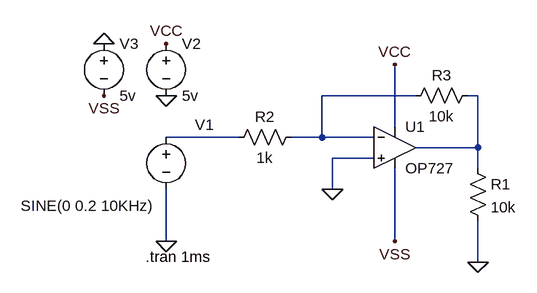
[diagram p0: schematic template1.asc]
template1.asc, the LTspice schematic file:
Version 4
SHEET 1 880 680
WIRE 80 32 -64 32
WIRE 176 32 160 32
WIRE 48 80 48 -16
WIRE -192 96 -304 96
WIRE -64 96 -64 32
WIRE -64 96 -112 96
WIRE 16 96 -64 96
WIRE 176 112 176 32
WIRE 176 112 80 112
WIRE 16 128 -48 128
WIRE 176 144 176 112
WIRE -48 176 -48 128
WIRE -304 256 -304 176
WIRE 48 256 48 144
WIRE 176 288 176 224
FLAG 176 288 0
FLAG -304 256 0
FLAG 48 -16 VCC
FLAG -304 -48 VCC
FLAG -304 32 0
FLAG -48 176 0
FLAG 48 256 VSS
FLAG -400 -48 0
FLAG -400 32 VSS
SYMBOL res 160 128 R0
SYMATTR InstName R1
SYMATTR Value 10k
SYMBOL voltage -304 80 R0
WINDOW 123 0 0 Left 0
WINDOW 39 0 0 Left 0
WINDOW 0 44 -3 Left 2
WINDOW 3 -224 121 Left 2
SYMATTR InstName V1
SYMATTR Value SINE(0 0.2 10KHz)
SYMBOL voltage -304 -64 R0
WINDOW 123 0 0 Left 0
WINDOW 39 0 0 Left 0
SYMATTR InstName V2
SYMATTR Value 5v
SYMBOL OP727 48 48 R0
SYMATTR InstName U1
SYMBOL Res -96 80 R90
WINDOW 0 0 56 VBottom 2
WINDOW 3 32 56 VTop 2
SYMATTR InstName R2
SYMATTR Value 1k
SYMBOL Res 176 16 R90
WINDOW 0 0 56 VBottom 2
WINDOW 3 32 56 VTop 2
SYMATTR InstName R3
SYMATTR Value 10k
SYMBOL voltage -400 -64 R0
WINDOW 123 0 0 Left 0
WINDOW 39 0 0 Left 0
SYMATTR InstName V3
SYMATTR Value 5v
TEXT -336 280 Left 2 !.tran 1ms

The netlist it stands for:
* template1.asc
R1 N002 0 10k
V1 N003 0 SINE(0 0.2 10KHz)
V2 VCC 0 5v
* U1: OP727 (symbol OP727 not available, pins judged from their places): In+=0 In-=N001 V+=VCC V-=VSS OUT=N002
R2 N001 N003 1k
R3 N002 N001 10k
V3 0 VSS 5v
.tran 1ms
.backanno
.end